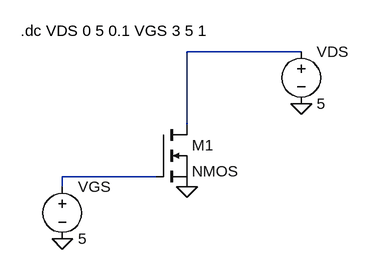
[diagram p0: schematic NMOS Xtics simulation.asc]
NMOS Xtics simulation.asc, the LTspice schematic file:
Version 4.1
SHEET 1 880 680
WIRE 400 0 224 0
WIRE 224 112 224 0
WIRE 176 192 32 192
WIRE 32 208 32 192
FLAG 400 80 0
FLAG 224 208 0
FLAG 32 288 0
SYMBOL nmos 176 112 R0
SYMATTR InstName M1
SYMBOL voltage 32 192 R0
WINDOW 123 0 0 Left 0
WINDOW 39 0 0 Left 0
SYMATTR InstName VGS
SYMATTR Value 5
SYMBOL voltage 400 -16 R0
WINDOW 123 0 0 Left 0
WINDOW 39 0 0 Left 0
SYMATTR InstName VDS
SYMATTR Value 5
TEXT -32 -32 Left 2 !.dc VDS 0 5 0.1 VGS 3 5 1

The netlist it stands for:
* NMOS Xtics simulation.asc
M1 N001 N002 0 0 NMOS
VGS N002 0 5
VDS N001 0 5
.model NMOS NMOS
.model PMOS PMOS
.lib standard.mos
.dc VDS 0 5 0.1 VGS 3 5 1
.backanno
.end